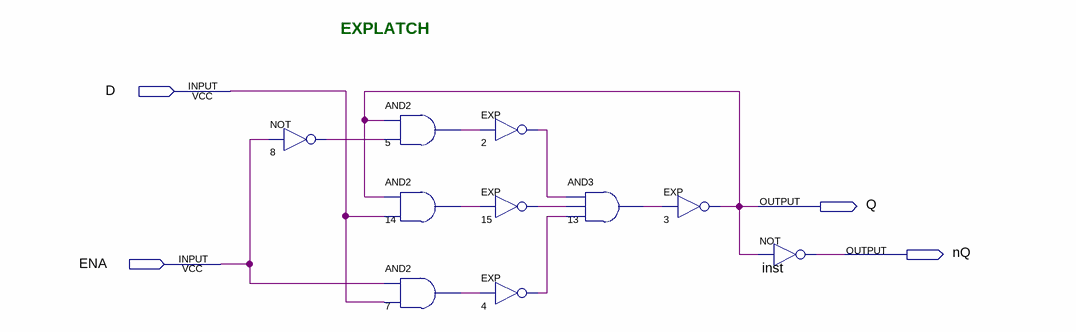
[diagram p0: schematic sheet]
// Quartus schematic dtrig.bdf as structural Verilog: 10 symbols, 4 pins
module dtrig (
  input  D,
  input  ENA,
  output Q,
  output nQ
);

  wire n2_out, n4_out, n5_out, n7_out, n8_out, n13_out, n14_out, n15_out;

  not u_8 (n8_out, ENA);
  and u_5 (n5_out, Q, n8_out);
  and u_14 (n14_out, Q, D);
  and u_7 (n7_out, ENA, D);
  EXP u_2 (.IN(n5_out), .OUT(n2_out));
  EXP u_15 (.IN(n14_out), .OUT(n15_out));
  EXP u_4 (.IN(n7_out), .OUT(n4_out));
  and u_13 (n13_out, n2_out, n15_out, n4_out);
  EXP u_3 (.IN(n13_out), .OUT(Q));
  not inst (nQ, Q);

  // Notes on the sheet:
  //   EXPLATCH
endmodule
